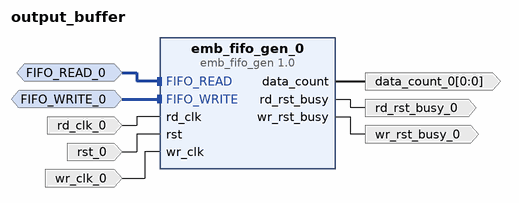
[diagram p0: block diagram of the top level]
# Vivado block design output_buffer, xcvc1902-vsva2197-2MP-e-S, Vivado 2021.1
create_bd_design output_buffer

create_bd_intf_port -mode Slave -vlnv xilinx.com:interface:fifo_read_rtl:1.0 FIFO_READ_0
create_bd_intf_port -mode Slave -vlnv xilinx.com:interface:fifo_write_rtl:1.0 FIFO_WRITE_0
create_bd_port -dir O -from 0 -to 0 data_count_0
create_bd_port -dir I -type clk rd_clk_0
create_bd_port -dir O rd_rst_busy_0
create_bd_port -dir I rst_0
create_bd_port -dir I -type clk wr_clk_0
create_bd_port -dir O wr_rst_busy_0

create_bd_cell -type ip -vlnv xilinx.com:ip:emb_fifo_gen:1.0 emb_fifo_gen_0
set_property -dict [list \
  CONFIG.CLOCK_DOMAIN Independent_Clock \
  CONFIG.DATA_COUNT_WIDTH 0 \
  CONFIG.ENABLE_ALMOST_EMPTY false \
  CONFIG.ENABLE_ALMOST_FULL false \
  CONFIG.ENABLE_OVERFLOW false \
  CONFIG.ENABLE_PROGRAMMABLE_EMPTY false \
  CONFIG.ENABLE_PROGRAMMABLE_FULL false \
  CONFIG.ENABLE_READ_DATA_COUNT false \
  CONFIG.ENABLE_READ_DATA_VALID false \
  CONFIG.ENABLE_UNDERFLOW false \
  CONFIG.ENABLE_WRITE_ACK false \
  CONFIG.ENABLE_WRITE_DATA_COUNT false \
  CONFIG.FIFO_WRITE_DEPTH 512 \
  CONFIG.WRITE_DATA_WIDTH 16 \
] [get_bd_cells emb_fifo_gen_0]

# ---- connections ----

connect_bd_intf_net -intf_net FIFO_READ_0_1 [get_bd_intf_ports FIFO_READ_0] [get_bd_intf_pins emb_fifo_gen_0/FIFO_READ]
connect_bd_intf_net -intf_net FIFO_WRITE_0_1 [get_bd_intf_ports FIFO_WRITE_0] [get_bd_intf_pins emb_fifo_gen_0/FIFO_WRITE]
connect_bd_net [get_bd_pins emb_fifo_gen_0/data_count] [get_bd_ports data_count_0]
connect_bd_net [get_bd_pins emb_fifo_gen_0/rd_rst_busy] [get_bd_ports rd_rst_busy_0]
connect_bd_net [get_bd_pins emb_fifo_gen_0/wr_rst_busy] [get_bd_ports wr_rst_busy_0]
connect_bd_net -net rd_clk_0_1 [get_bd_ports rd_clk_0] [get_bd_pins emb_fifo_gen_0/rd_clk]
connect_bd_net -net rst_0_1 [get_bd_ports rst_0] [get_bd_pins emb_fifo_gen_0/rst]
connect_bd_net -net wr_clk_0_1 [get_bd_ports wr_clk_0] [get_bd_pins emb_fifo_gen_0/wr_clk]

validate_bd_design
save_bd_design
